# EAGLE design gameglobe (EAGLE 6.5.0)
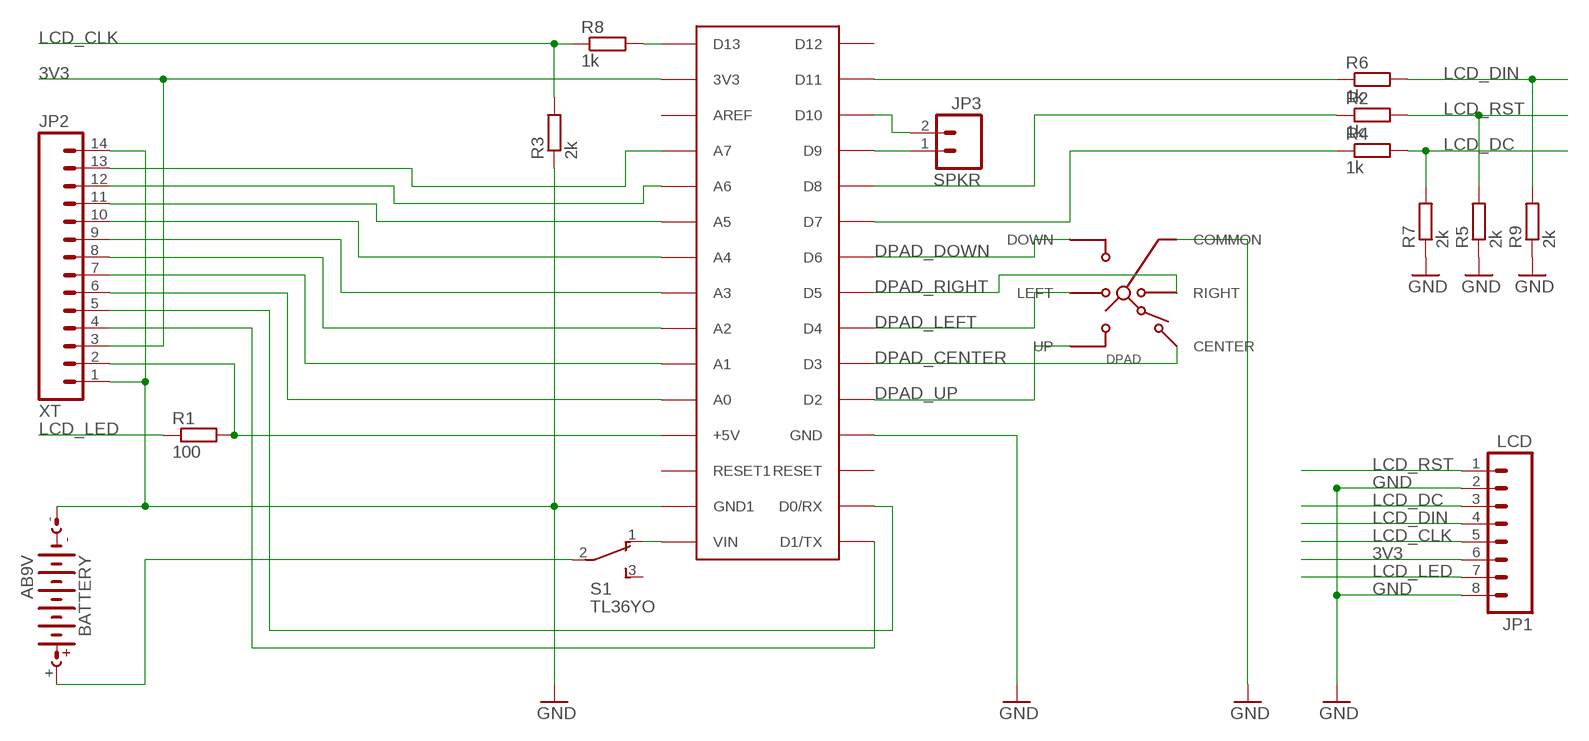
[diagram p0: schematic, sheet 1]

## Parts
ARDUINO_NANO  ARDUINONANO  [PDIP-32]
BATTERY  AB9V  [AB9V]
DPAD  SKQUCAA010  [SKQU]
JP1  LCD  M08  [1X08_ROUND]
JP2  XT  M14LONGPADS  [1X14-LONGPADS]
JP3  SPKR  M02PTH  [1X02]
R1  100  R-EU_0411/15  [0411/15]
R2  1k  R-EU_0411/15  [0411/15]
R3  2k  R-EU_0411/15  [0411/15]
R4  1k  R-EU_0411/15  [0411/15]
R5  2k  R-EU_0411/15  [0411/15]
R6  1k  R-EU_0411/15  [0411/15]
R7  2k  R-EU_0411/15  [0411/15]
R8  1k  R-EU_0411/15  [0411/15]
R9  2k  R-EU_0411/15  [0411/15]
S1  TL36YO  [TL3XYO]

## Nets
3V3: ARDUINO_NANO.3V3 JP1.6 JP2.3
5V: ARDUINO_NANO.+5V JP2.2 R1.2
A0: ARDUINO_NANO.A0 JP2.6
A1: ARDUINO_NANO.A1 JP2.7
A2: ARDUINO_NANO.A2 JP2.8
A3: ARDUINO_NANO.A3 JP2.9
A4: ARDUINO_NANO.A4 JP2.10
A5: ARDUINO_NANO.A5 JP2.11
A6: ARDUINO_NANO.A6 JP2.12
A7: ARDUINO_NANO.A7 JP2.13
DPAD_CENTER: ARDUINO_NANO.D3 DPAD.CENTER
DPAD_DOWN: ARDUINO_NANO.D6 DPAD.DOWN
DPAD_LEFT: ARDUINO_NANO.D4 DPAD.LEFT
DPAD_RIGHT: ARDUINO_NANO.D5 DPAD.RIGHT
DPAD_UP: ARDUINO_NANO.D2 DPAD.UP
GND: ARDUINO_NANO.GND ARDUINO_NANO.GND1 BATTERY.- DPAD.COMMON JP1.2 JP1.8 JP2.1 JP2.14 R3.1 R5.1 R7.1 R9.1
LCD_CLK: JP1.5 R3.2 R8.1
LCD_DC: JP1.3 R4.2 R7.2
LCD_DIN: JP1.4 R6.2 R9.2
LCD_LED: JP1.7 R1.1
LCD_RST: JP1.1 R2.2 R5.2
N$1: ARDUINO_NANO.D13 R8.2
N$2: ARDUINO_NANO.D11 R6.1
N$3: ARDUINO_NANO.D8 R2.1
N$4: ARDUINO_NANO.D9 JP3.1
N$5: ARDUINO_NANO.VIN S1.1(O)
N$6: BATTERY.+ S1.2(P)
N$10: ARDUINO_NANO.D10 JP3.2
N$20: ARDUINO_NANO.D7 R4.1
RX: ARDUINO_NANO.D0/RX JP2.5
TX: ARDUINO_NANO.D1/TX JP2.4
Unconnected: ARDUINO_NANO.AREF ARDUINO_NANO.D12 ARDUINO_NANO.RESET ARDUINO_NANO.RESET1 S1.3(S)

## Library data of the parts
ARDUINO_NANO = arduino_nano:ARDUINONANO
BATTERY = battery:AB9V: 9-V BATTERY CLIP
DPAD = gamaral:SKQU: Multi Control Devices TACT Switch - 4-directional with Center Push Type. SKQU Series.; MF: ALPS; OC_ADAFRUIT: 504; OC_MOUSER: 688-SKQUCA; OC_NEWARK: 59M1983
JP1 = SparkFun-Connectors:M08: Header 8 Standard 8-pin 0.1" header. Use with straight break away headers (SKU : PRT-00116), right angle break away headers (PRT-00553), swiss pins (PRT-00743), machine pins (PRT-00117), and female headers (PRT-00115).
JP2 = SparkFun-Connectors:M14: Header 14 Standard 14-pin 0.1" header. Use with straight break away headers (SKU : PRT-00116), right angle break away headers (PRT-00553), swiss pins (PRT-00743), machine pins (PRT-00117), and female headers (PRT-00115).
JP3 = SparkFun-Connectors:M02: Standard 2-pin 0.1" header. Use with - straight break away headers ( PRT-00116) - right angle break away headers (PRT-00553) - swiss pins (PRT-00743) - machine pins (PRT-00117) - female headers (PRT-00115) Molex polarized connector foot print use with: PRT-08233 with associated crimp pins and housings. 2.54_SCREWTERM for use with PRT-10571. 3.5mm Screw Terminal footprints for PRT-08084 5mm Screw Terminal footprints for use with PRT-08432
R1-R9 = resistor:R-EU_: RESISTOR, European symbol
S1 = switch:TL36YO: TINY SWITCH ON - ON Source: http://www2.produktinfo.conrad.com/datenblaetter/700000-724999/705152-da-01-de-Subminiaturschalter_TL_36YO.pdf

## Board
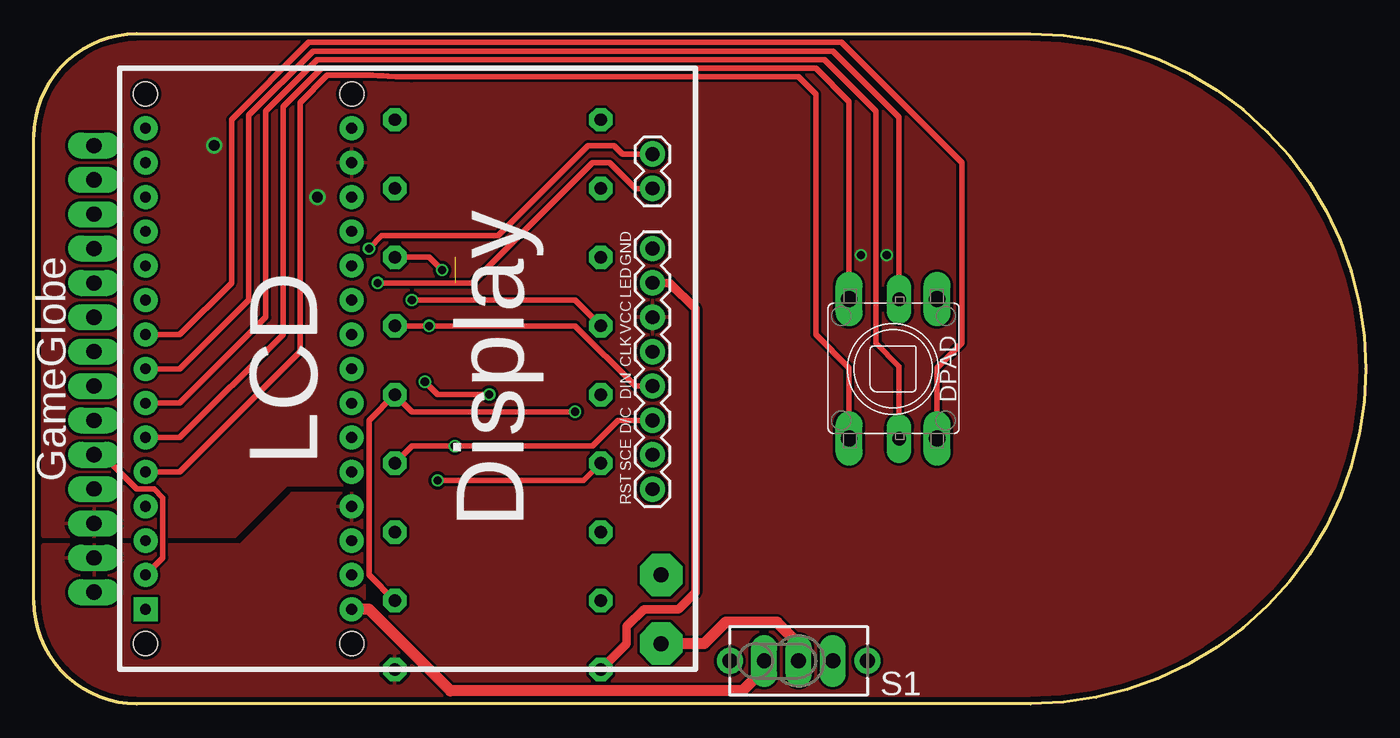
[diagram p1: board, top side]
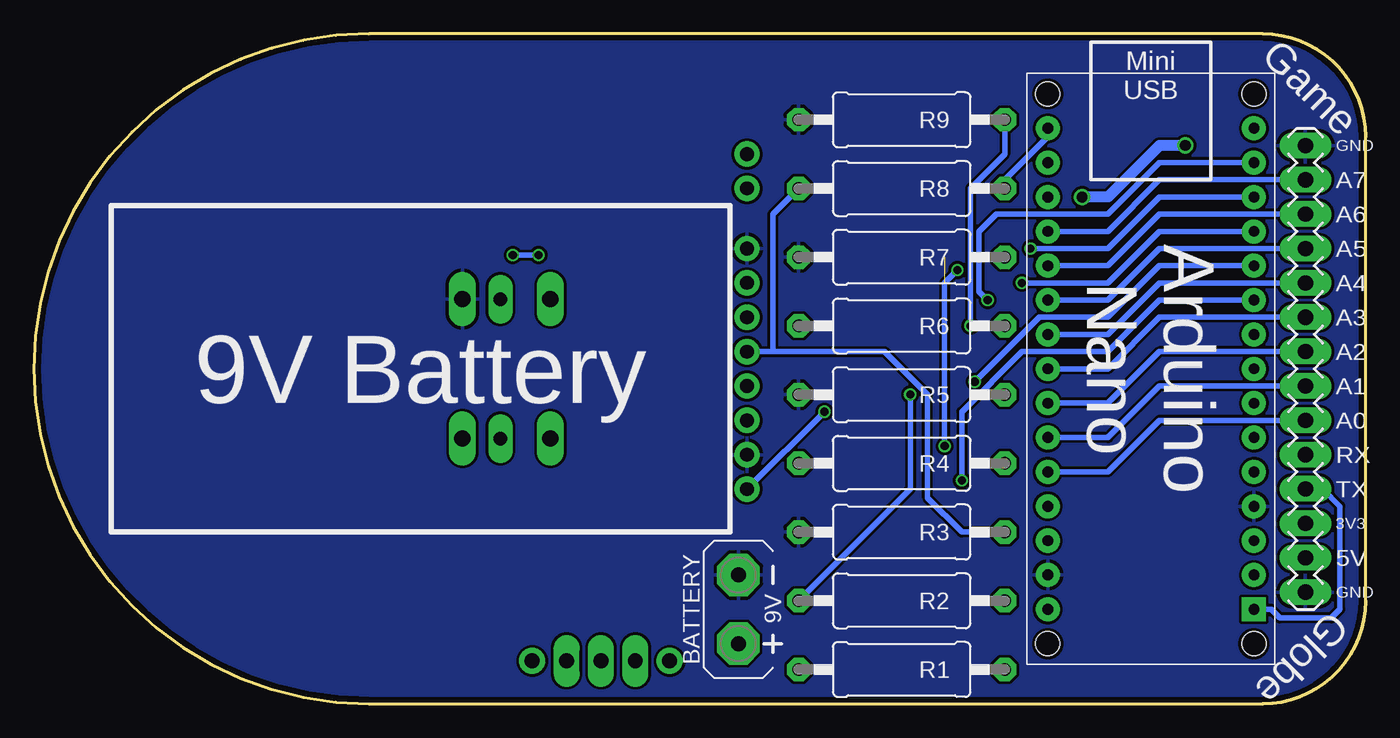
[diagram p2: board, bottom side, seen from below]

Size 98.42 x 49.53 mm. Coordinates in mm from the lower left corner, seen from the top.
Outline: 73.66,0 7.62,0 arc-90 0,7.62 0,41.91 arc-90 7.62,49.53 73.66,49.53 arc-180 73.66,0
Copper layers (1*16): Top 0.035mm / dielectric 1.5mm / Bottom 0.035mm
Design rules "dirt_cheap_dirty_boards.v1_larger_pads": minimum track width 5mil, minimum drill 12mil, track to track 5mil, track to pad 5mil, pad to pad 5mil, via to via 5mil, smd to smd 0mil, copper to edge 10mil, drill to drill 10mil, minimum pad ring 16mil, minimum via ring 6mil, stop-mask expansion 2mil, vias tented up to drill 25mil, thermal gap 10mil

### Footprints (pad centres in the part's own frame; a part is rotated, then mirrored left to right if it is on the bottom)
PDIP-32 = drill 0.8 pad 1.778: 3V3 15.24,-35.56; +5V 15.24,-10.16; A0 15.24,-12.7; A1 15.24,-15.24; A2 15.24,-17.78; A3 15.24,-20.32; A4 15.24,-22.86; A5 15.24,-25.4; A6 15.24,-27.94; A7 15.24,-30.48; AREF 15.24,-33.02; D0/RX 0,-5.08; D2 0,-12.7; D3 0,-15.24; D4 0,-17.78; D5 0,-20.32; D6 0,-22.86; D7 0,-25.4; D8 0,-27.94; D9 0,-30.48; D10 0,-33.02; D11 0,-35.56; D12 0,-38.1; D13 15.24,-38.1; GND 0,-10.16; GND1 15.24,-5.08; RESET 0,-7.62; RESET1 15.24,-7.62; VIN 15.24,-2.54 | drill 0.8 pad 1.778 square: D1/TX 0,-2.54 | hole 1.778: 0,0; 0,-40.64; 15.24,-40.64; 15.24,0
AB9V = drill 1.118 pad 3.15 octagon: + 0,2.54; - 0,-2.54
SKQU = drill 1.2 long: CENTER 5.15,3.25; COMMON 5.15,-3.25; DOWN -5.15,-3.25; UP -5.15,3.25 | drill 1 long: LEFT -5.15,-0.45; RIGHT 5.15,-0.45
1X08_ROUND = drill 1.016 pad 1.88: 1 0,0; 2 2.54,0; 3 5.08,0; 4 7.62,0; 5 10.16,0; 6 12.7,0; 7 15.24,0; 8 17.78,0
1X14-LONGPADS = drill 1.118 long: 1 0,0; 2 2.54,0; 3 5.08,0; 4 7.62,0; 5 10.16,0; 6 12.7,0; 7 15.24,0; 8 17.78,0; 9 20.32,0; 10 22.86,0; 11 25.4,0; 12 27.94,0; 13 30.48,0; 14 33.02,0
1X02 = drill 1.016 pad 1.88: 1 0,0; 2 2.54,0
0411/15 = drill 0.914 octagon: 1 -7.62,0; 2 7.62,0
TL3XYO = drill 1.1 pad 1.422 long: 1 -2.54,0; 2 0,0; 3 2.54,0 | drill 1.1 pad 1.676: M1 -5.08,0; M2 5.08,0

### Placement (x,y rotation side)
ARDUINO_NANO  8.26,4.45 180 bottom
BATTERY  46.35,6.99 180 bottom
DPAD  63.5,24.76 90 top
JP1  45.72,15.88 90 top
JP2  4.45,8.26 90 bottom
JP3  45.72,38.1 90 top
R1  34.29,2.54 0 bottom
R2  34.29,7.62 0 bottom
R3  34.29,12.7 0 bottom
R4  34.29,17.78 0 bottom
R5  34.29,22.86 0 bottom
R6  34.29,27.94 0 bottom
R7  34.29,33.02 0 bottom
R8  34.29,38.1 0 bottom
R9  34.29,43.18 0 bottom
S1  56.52,3.17 0 top

### Tracks (layer width: path | path; a pad name or v marks a point on that pad's centre or on a via)
3V3  (via drill 0.6, 0.8)
  Bottom 0.406: v63.02,33.18 v61.12,33.18
  Bottom 0.813: v13.34,41.27 15.24,41.27 19.05,37.47 v20.95,37.47
  pour Top (isolate 0.203): 0.64,12.38 14.92,12.38 18.73,16.19 25.08,16.19 25.08,7.3 31.75,0.64 73.66,0.64 arc90 97.79,24.76 arc90 73.66,48.9 7.62,48.9 arc90 0.64,41.91
5V
  pour Top (isolate 0.203): 0.64,11.75 0.64,7.62 arc90 7.62,0.64 30.48,0.64 24.45,6.67 24.45,15.56 19.05,15.56 15.24,11.75
A0
  Bottom 0.406: JP2.6 15.24,20.95 19.05,17.14 ARDUINO_NANO.A0
A1
  Bottom 0.406: JP2.7 15.24,23.49 19.05,19.68 ARDUINO_NANO.A1
A2
  Bottom 0.406: JP2.8 15.24,26.04 19.05,22.22 ARDUINO_NANO.A2
A3
  Bottom 0.406: JP2.9 15.24,28.57 19.05,24.76 ARDUINO_NANO.A3
A4
  Bottom 0.406: JP2.10 15.24,31.11 19.05,27.3 ARDUINO_NANO.A4
A5
  Bottom 0.406: JP2.11 15.24,33.66 19.05,29.84 ARDUINO_NANO.A5
A6
  Bottom 0.406: JP2.12 15.24,36.2 19.05,32.39 ARDUINO_NANO.A6
A7
  Bottom 0.406: JP2.13 15.24,38.73 19.05,34.93 ARDUINO_NANO.A7
DPAD_CENTER
  Top 0.406: DPAD.CENTER 60.25,44.52 57.78,46.99 21.27,46.99 18.41,44.13 18.41,27.3 10.79,19.68 ARDUINO_NANO.D3
DPAD_DOWN
  Top 0.406: DPAD.DOWN 66.75,24.84 68.58,26.67 68.58,40.01 59.69,48.9 20.32,48.9 14.61,43.18 14.61,31.11 10.79,27.3 ARDUINO_NANO.D6
DPAD_LEFT
  Top 0.406: ARDUINO_NANO.D4 10.79,22.22 17.14,28.57 17.14,43.82 20.95,47.62 58.42,47.62 62.23,43.82 62.23,26.67 63.95,24.95 DPAD.LEFT
DPAD_RIGHT
  Top 0.406: DPAD.RIGHT 63.95,43.37 59.05,48.26 20.64,48.26 15.88,43.5 15.88,29.84 10.79,24.76 ARDUINO_NANO.D5
DPAD_UP
  Top 0.406: DPAD.UP 60.25,24.84 57.78,27.3 57.78,45.09 56.52,46.36 27.91,46.36 arc-3 26.19,46.41 arc5 25.04,46.46 21.69,46.46 19.68,44.45 19.68,26.04 10.79,17.14 ARDUINO_NANO.D2
GND
  pour Bottom (isolate 0.203): 24.13,0.64 7.62,0.64 arc-90 0.64,7.62 0.64,41.91 arc-90 7.62,48.9 8.26,48.9 73.66,48.9 arc-90 97.79,24.76 arc-90 73.66,0.64
LCD_CLK
  Bottom 0.406: R3.2 29.84,12.7 32.38,15.24 32.38,22.86 35.56,26.04 43.81,26.04 | 43.81,26.04 43.81,36.2 R8.1 | JP1.5 43.81,26.04
LCD_DC  (via drill 0.6)  (1 unrouted)
  Top 0.406: JP1.3 43.18,20.95 41.27,19.05 v31.11,19.05 27.94,19.05 R4.2 | R7.2 29.21,33.02 v30.16,32.07
  Bottom 0.406: v31.11,19.05 31.11,31.11 v30.16,32.07
LCD_DIN  (via drill 0.6)
  Top 0.406: JP1.4 44.45,23.49 40.01,27.94 v29.21,27.94 R6.2
  Bottom 0.406: R9.2 26.67,40.64 29.21,38.1 v29.21,27.94
LCD_LED
  Top 0.61: JP1.7 46.99,31.11 48.9,29.21 48.9,8.26 47.62,6.99 45.09,6.99 43.81,5.71 43.81,4.45 R1.1
LCD_RST  (via drill 0.6)
  Top 0.406: v40.01,21.59 27.94,21.59 R5.2 24.77,20.95 24.77,9.53 R2.2
  Bottom 0.406: JP1.1 v40.01,21.59
N$1
  Bottom 0.406: ARDUINO_NANO.D13 23.5,41.91 26.67,38.73 R8.2
N$2  (via drill 0.6)
  Top 0.406: v27.94,29.84 40.01,29.84 R6.1
  Bottom 0.406: ARDUINO_NANO.D11 15.24,40.01 19.05,36.2 27.3,36.2 28.57,34.93 28.57,30.48 v27.94,29.84
N$3  (via drill 0.6)
  Top 0.406: v28.89,23.81 29.84,22.86 v33.66,22.86
  Bottom 0.406: ARDUINO_NANO.D8 15.24,32.39 19.05,28.57 24.13,28.57 v28.89,23.81 | v33.66,22.86 33.66,15.88 R2.1
N$4  (via drill 0.6)
  Top 0.406: JP3.1 44.45,38.1 42.55,40.01 41.27,40.01 32.38,31.11 v25.4,31.11
  Bottom 0.406: ARDUINO_NANO.D9 15.24,34.93 19.05,31.11 v25.4,31.11
N$5
  Top 0.813: S1.1 53.98,2.54 52.39,0.95 30.8,0.95 24.77,6.99 ARDUINO_NANO.VIN
N$6
  Top 0.813: S1.2 56.52,4.45 54.93,6.03 51.12,6.03 49.53,4.45 BATTERY.+
N$10  (via drill 0.6)
  Top 0.406: v24.77,33.66 25.72,34.61 34.29,34.61 40.96,41.27 42.86,41.27 43.5,40.64 JP3.2
  Bottom 0.406: ARDUINO_NANO.D10 15.24,37.47 19.05,33.66 v24.77,33.66
N$20  (via drill 0.6)
  Top 0.406: v29.84,16.51 40.64,16.51 R4.1
  Bottom 0.406: v29.84,16.51 29.84,21.59 25.4,26.04 19.05,26.04 15.24,29.84 ARDUINO_NANO.D7
RX
  Top 0.406: ARDUINO_NANO.D0/RX 9.53,10.79 9.53,15.24 8.89,15.88 7.62,15.88 5.08,18.41 JP2.5
TX
  Bottom 0.406: JP2.4 3.17,15.88 1.91,14.61 1.91,6.99 2.54,6.35 6.35,6.35 6.99,6.99 ARDUINO_NANO.D1/TX

### Text on the board
tPlace: GameGlobe | LCD / / Display
bPlace: Mini / USB | Game | Globe
tNames: GND | LED | VCC | CLK | DIN | D/C | SCE | RST
bNames: GND | A7 | A6 | A5 | A4 | A3 | A2 | Arduino / Nano | 9V Battery | A1 | A0 | RX | TX | 3V3 | 5V | GND
tValues: 3V3 | 5V
bValues: http://v.ht/3310